# Altium project MCU036A_MSP-EXP430FR2355.PrjPcb (part 2 of 3)
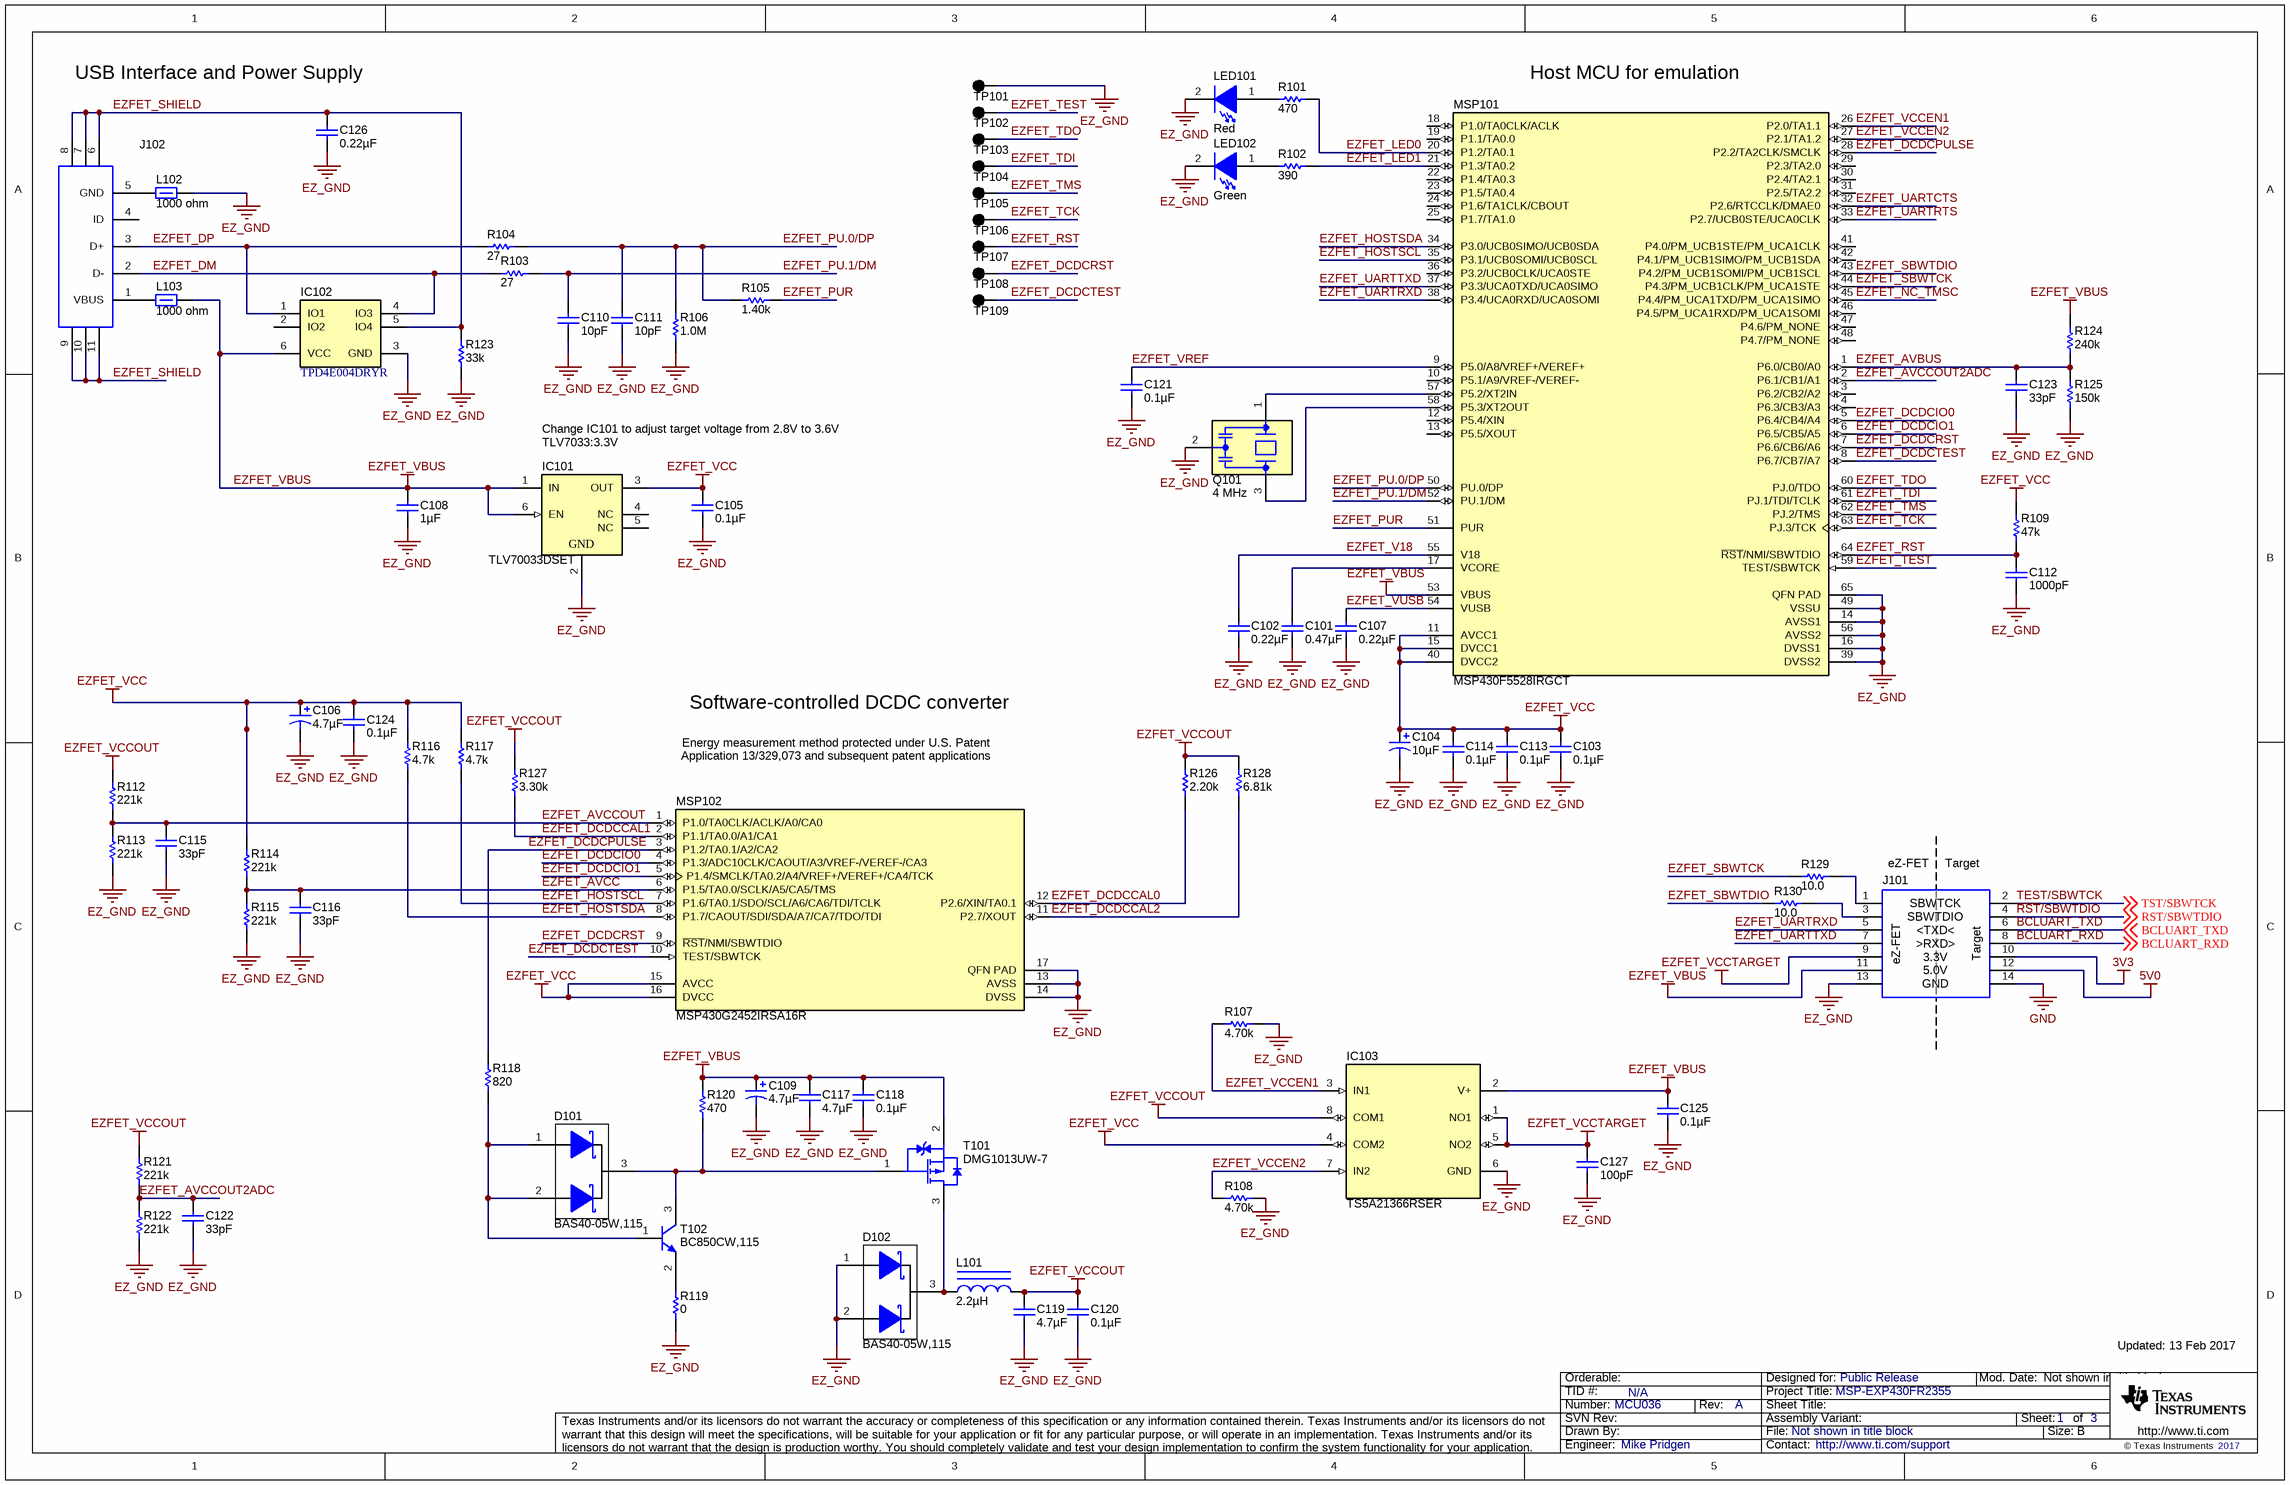
[diagram p3: MCU036A_eZFET_1.4.SchDoc]

## Sheet MCU036A_eZFET_1.4.SchDoc (continued)

### Library data of the parts
C101 = GRM155R61C474KE01: CAP, CERM, 0.47 µF, 16 V, +/- 10%, X5R, 0402; Manufacturer: MuRata; Polarized: N; CompType: Capacitor; Value: 0.47uF; U/M: EA; Cap_F: 0.00000047; Tolerance_%: 10; Value1: Unknown; VDC_V: 16; Value2: 16V; TaMin_C: -55; TaMax_C: 85; SizeArea_mm2: 0.5; SizeAreaWB_mm2: 3; SizeX_mm: 1; SizeZ_mm: 0.6; AEC Category: Q200; SymbolVersion: 2008-07-09; PartNumber: GRM155R61C474KE01; PackageReference: 0402; RoHS: Y; MountType: SMT; Technology: Ceramic; TempCo: X5R; Cap_Case: 0402; SizeY_mm: 0.5; Published: 2008-06-19; Publisher: Texas Instruments; LatestRevisionDate: 2017-01-09; ComponentLink1Description: Datasheet link; ComponentLink1URL: http://psearch.murata.com/capacitor/product/GRM155R61C474KE01%23.pdf; AEC Qualified: ?
C102 C107 = GRM188R61C224KA88D: CAP, CERM, 0.22 µF, 16 V, +/- 10%, X5R, 0603; Manufacturer: MuRata; Polarized: N; CompType: Capacitor; Value: 0.22uF; U/M: EA; Cap_F: 0.00000022; Tolerance_%: 10; Value1: Unknown; VDC_V: 16; Value2: 16V; TaMin_C: -55; TaMax_C: 85; SizeArea_mm2: 1.28; SizeAreaWB_mm2: 4.68; SizeX_mm: 1.6; SizeY_mm: 0.8; SizeZ_mm: 1; AEC Category: Q200; SymbolVersion: 2008-07-09; PartNumber: GRM188R61C224KA88D; PackageReference: 0603; RoHS: Y; MountType: SMT; Technology: Ceramic; TempCo: X5R; Cap_Case: 0603; Published: 2008-06-19; Publisher: Texas Instruments; LatestRevisionDate: 2017-01-09; ComponentLink1Description: Datasheet link; ComponentLink1URL: http://search.murata.co.jp/Ceramy/PnsearchViewAction.do?HnOFG=ON&HnNFG=ON&SEL_CNT=50&sLang=en&sKey=GRM188R61C224KA88D&x=9&y=9&search=startwith; Supplier 1: Digi-Key; Supplier Part Number 1: GRM188R61C224KA88D-ND; Supplier 2: Mouser; Supplier Part Number 2: 81-GRM188R61C224KA8D; AEC Qualified: ?
C103 C105 C113 C114 C118 C120 C121 C124 C125 = GRM155R61A104KA01D: CAP, CERM, 0.1 µF, 10 V, +/- 10%, X5R, 0402; Manufacturer: MuRata; Polarized: N; CompType: Capacitor; Value: 0.1uF; U/M: EA; Cap_F: 0.0000001; Tolerance_%: 10; Value1: Unknown; Value2: 10V; TaMin_C: -55; TaMax_C: 85; SizeArea_mm2: 0.5; SizeAreaWB_mm2: 3; SizeX_mm: 1; SizeZ_mm: 0.6; AEC Category: Q200; SymbolVersion: 2008-07-09; PartNumber: GRM155R61A104KA01D; PackageReference: 0402; RoHS: Y; VDC_V: 10; MountType: SMT; Technology: Ceramic; TempCo: X5R; Cap_Case: 0402; SizeY_mm: 0.5; Published: 2008-06-19; Publisher: Texas Instruments; LatestRevisionDate: 2017-01-09; ComponentLink1Description: Datasheet link; ComponentLink1URL: http://search.murata.co.jp/Ceramy/PnsearchViewAction.do?HnOFG=ON&HnNFG=ON&SEL_CNT=50&sLang=en&sKey=GRM155R61A104KA01D&x=9&y=9&search=startwith; Supplier 1: Digi-Key; Supplier Part Number 1: 490-1318-1-ND; Supplier 2: Mouser; Supplier Part Number 2: 81-GRM155R61A104KA01; Supplier 3: Farnell; Supplier Part Number 3: 1828862; AEC Qualified: ?
C104 = 293D106X0010A2TE3: CAP, TA, 10 µF, 10 V, +/- 20%, 3.4 ohm, SMD; Manufacturer: Vishay-Sprague; Polarized: Y; CompType: Capacitor; Value: 10uF; U/M: EA; Cap_F: 0.00001; Tolerance_%: 20; Value1: 3.4 ohm; VDC_V: 10; Value2: 10V; ESR_ohm: 3.4; IRMS_A: 0.15; TaMin_C: -55; TaMax_C: 125; Cap_Case: A; SizeAreaWB_mm2: 10.92; SizeArea_mm2: 5.12; SizeX_mm: 3.2; SizeY_mm: 1.6; SizeZ_mm: 1.8; AEC Category: Q200; SymbolVersion: 2008-07-09; PartNumber: 293D106X0010A2TE3; PackageReference: 3216-18; RoHS: Y; MountType: SMT; Technology: TA; Series: 293D; Publisher: Texas Instruments; LatestRevisionDate: 2016-12-27; LatestRevisionNote: Updated supplier links; ComponentLink1Description: Datasheet link; ComponentLink1URL: http://www.vishay.com/docs/40002/293d.pdf; Supplier 1: Digi-Key; Supplier Part Number 1: 718-1118-1-ND; Supplier 2: Mouser; Supplier Part Number 2: 74-293D106X0010A2TE3; Supplier 3: Farnell; Supplier Part Number 3: 1432565; AEC Qualified: ?
C106 C109 = 293D475X9010A2TE3: CAP, TA, 4.7 µF, 10 V, +/- 10%, 5 ohm, SMD; Manufacturer: Vishay-Sprague; Polarized: Y; CompType: Capacitor; Value: 4.7uF; U/M: EA; Cap_F: 0.0000047; Tolerance_%: 10; Value1: 5 ohm; Value2: 10V; ESR_ohm: 5; IRMS_A: 0.12; TaMin_C: -55; TaMax_C: 125; Cap_Case: A; SizeAreaWB_mm2: 10.92; SizeArea_mm2: 5.12; SizeX_mm: 3.2; SizeY_mm: 1.6; SizeZ_mm: 1.8; AEC Category: Q200; SymbolVersion: 2008-07-09; PartNumber: 293D475X9010A2TE3; PackageReference: 3216-18; RoHS: Y; VDC_V: 10; MountType: SMT; Technology: TA; Series: 293D; Publisher: Texas Instruments; LatestRevisionDate: 2016-12-27; LatestRevisionNote: Updated supplier links; ComponentLink1Description: Datasheet link; ComponentLink1URL: http://www.vishay.com/docs/40002/293d.pdf; Supplier 1: Digi-Key; Supplier Part Number 1: 718-1146-1-ND; Supplier 2: Mouser; Supplier Part Number 2: 74-293D475X9010A2TE3; Supplier 3: Farnell; Supplier Part Number 3: 197397; AEC Qualified: ?
C108 = GRM185R61A105KE36D: CAP, CERM, 1 µF, 10 V, +/- 10%, X5R, 0603; Manufacturer: MuRata; Polarized: N; CompType: Capacitor; Value: 1uF; U/M: EA; Cap_F: 0.000001; Tolerance_%: 10; Value1: Unknown; Value2: 10V; TaMin_C: -55; TaMax_C: 85; SizeArea_mm2: 1.28; SizeAreaWB_mm2: 4.68; SizeX_mm: 1.6; SizeY_mm: 0.8; SizeZ_mm: 1; AEC Category: Q200; SymbolVersion: 2008-07-09; PartNumber: GRM185R61A105KE36D; PackageReference: 0603; RoHS: Y; VDC_V: 10; MountType: SMT; Technology: Ceramic; TempCo: X5R; Cap_Case: 0603; Published: 2008-06-19; Publisher: Texas Instruments; LatestRevisionDate: 2017-01-25; ComponentLink1Description: Datasheet link; ComponentLink1URL: http://search.murata.co.jp/Ceramy/PnsearchViewAction.do?HnOFG=ON&HnNFG=ON&SEL_CNT=50&sLang=en&sKey=GRM185R61A105KE36D&x=9&y=9&search=startwith; Supplier 1: Digi-Key; Supplier Part Number 1: 490-3893-1-ND; Supplier 2: Mouser; Supplier Part Number 2: 81-GRM185R61A105KE36; AEC Qualified: ?
C110 C111 = GRM1555C1H100JA01D: CAP, CERM, 10 pF, 50 V, +/- 5%, C0G/NP0, 0402; Manufacturer: MuRata; Polarized: N; CompType: Capacitor; Value: 10pF; U/M: EA; Cap_F: 0.00000000001; Tolerance_%: 5; Value1: Unknown; VDC_V: 50; Value2: 50V; TaMin_C: -55; TaMax_C: 125; SizeArea_mm2: 0.5; SizeAreaWB_mm2: 3; SizeX_mm: 1; SizeZ_mm: 0.6; AEC Category: Q200; SymbolVersion: 2008-07-09; PartNumber: GRM1555C1H100JA01D; PackageReference: 0402; RoHS: Y; MountType: SMT; Technology: Ceramic; TempCo: C0G/NP0; Cap_Case: 0402; SizeY_mm: 0.5; Published: 2008-06-19; Publisher: Texas Instruments; LatestRevisionDate: 2017-01-09; ComponentLink1Description: Datasheet link; ComponentLink1URL: http://search.murata.co.jp/Ceramy/PnsearchViewAction.do?HnOFG=ON&HnNFG=ON&SEL_CNT=50&sLang=en&sKey=GRM1555C1H100JA01D&x=9&y=9&search=startwith; Supplier 1: Mouser; Supplier Part Number 1: 81-GRM1555C1H100JA1D; AEC Qualified: ?
C112 = GRM155R71H102KA01D: CAP, CERM, 1000 pF, 50 V, +/- 10%, X7R, 0402; Manufacturer: MuRata; Polarized: N; CompType: Capacitor; Value: 1000pF; U/M: EA; Cap_F: 0.000000001; Tolerance_%: 10; Value1: Unknown; VDC_V: 50; Value2: 50V; TaMin_C: -55; TaMax_C: 125; SizeArea_mm2: 0.5; SizeAreaWB_mm2: 3; SizeX_mm: 1; SizeZ_mm: 0.6; AEC Category: Q200; SymbolVersion: 2008-07-09; PartNumber: GRM155R71H102KA01D; PackageReference: 0402; RoHS: Y; MountType: SMT; Technology: Ceramic; TempCo: X7R; Cap_Case: 0402; SizeY_mm: 0.5; Published: 2008-06-19; Publisher: Texas Instruments; LatestRevisionDate: 2017-01-09; ComponentLink1Description: Datasheet link; ComponentLink1URL: http://search.murata.co.jp/Ceramy/PnsearchViewAction.do?HnOFG=ON&HnNFG=ON&SEL_CNT=50&sLang=en&sKey=GRM155R71H102KA01D&x=9&y=9&search=startwith; Supplier 1: Digi-Key; Supplier Part Number 1: 490-1303-1-ND; Supplier 2: Mouser; Supplier Part Number 2: 81-GRM36X102K50; Supplier 3: Farnell; Supplier Part Number 3: 1828882; AEC Qualified: ?
C115 C116 C122 C123 = GRM1555C1H330JA01D: CAP, CERM, 33 pF, 50 V, +/- 5%, C0G/NP0, 0402; Manufacturer: MuRata; Polarized: N; CompType: Capacitor; Value: 33pF; U/M: EA; Cap_F: 0.000000000033; Tolerance_%: 5; Value1: Unknown; VDC_V: 50; Value2: 50V; TaMin_C: -55; TaMax_C: 125; SizeArea_mm2: 0.5; SizeAreaWB_mm2: 3; SizeX_mm: 1; SizeZ_mm: 0.6; AEC Category: Q200; SymbolVersion: 2008-07-09; PartNumber: GRM1555C1H330JA01D; PackageReference: 0402; RoHS: Y; MountType: SMT; Technology: Ceramic; TempCo: C0G/NP0; Cap_Case: 0402; SizeY_mm: 0.5; Published: 2008-06-19; Publisher: Texas Instruments; LatestRevisionDate: 2017-01-09; ComponentLink1Description: Datasheet link; ComponentLink1URL: http://search.murata.co.jp/Ceramy/PnsearchViewAction.do?HnOFG=ON&HnNFG=ON&SEL_CNT=50&sLang=en&sKey=GRM1555C1H330JA01D&x=9&y=9&search=startwith; Supplier 1: Mouser; Supplier Part Number 1: 81-GRM1555C1H330JA1D; AEC Qualified: ?
C117 C119 = GRM188R61C475KAAJ: CAP, CERM, 4.7 µF, 16 V, +/- 10%, X5R, 0603; Manufacturer: MuRata; Polarized: N; CompType: Capacitor; Value: 4.7uF; U/M: EA; Cap_F: 0.0000047; Tolerance_%: 10; Value1: Unknown; VDC_V: 16; Value2: 16V; TaMin_C: -55; TaMax_C: 85; SizeArea_mm2: 1.28; SizeAreaWB_mm2: 4.68; SizeX_mm: 1.6; SizeY_mm: 0.8; SizeZ_mm: 1; AEC Category: Q200; SymbolVersion: 2008-07-09; PartNumber: GRM188R61C475KAAJ; PackageReference: 0603; RoHS: Y; MountType: SMT; Technology: Ceramic; TempCo: X5R; Cap_Case: 0603; Published: 2008-06-19; Publisher: Texas Instruments; LatestRevisionDate: 2017-01-09; ComponentLink1Description: Datasheet link; ComponentLink1URL: http://psearch.murata.com/capacitor/product/GRM188R61C475KAAJ%23.pdf; Supplier 1: Digi-Key; Supplier Part Number 1: 490-10481-1-ND; Supplier 2: Mouser; Supplier Part Number 2: 81-GRM188R61C475KAJD; AEC Qualified: N; AEC Grade: N/A
C126 = GRM155R61A224KE19D: CAP, CERM, 0.22 µF, 10 V, +/- 10%, X5R, 0402; Manufacturer: MuRata; Polarized: N; CompType: Capacitor; Value: 0.22uF; U/M: EA; Cap_F: 0.00000022; Tolerance_%: 10; Value1: Unknown; Value2: 10V; TaMin_C: -55; TaMax_C: 85; SizeArea_mm2: 0.5; SizeAreaWB_mm2: 3; SizeX_mm: 1; SizeZ_mm: 0.6; AEC Category: Q200; SymbolVersion: 2008-07-09; PartNumber: GRM155R61A224KE19D; PackageReference: 0402; RoHS: Y; VDC_V: 10; MountType: SMT; Technology: Ceramic; TempCo: X5R; Cap_Case: 0402; SizeY_mm: 0.5; Published: 2008-06-19; Publisher: Texas Instruments; LatestRevisionDate: 2017-01-25; ComponentLink1Description: Datasheet link; ComponentLink1URL: http://search.murata.co.jp/Ceramy/PnsearchViewAction.do?HnOFG=ON&HnNFG=ON&SEL_CNT=50&sLang=en&sKey=GRM155R61A224KE19D&x=9&y=9&search=startwith; Supplier 1: Digi-Key; Supplier Part Number 1: 490-3910-1-ND; Supplier 2: Mouser; Supplier Part Number 2: 81-GRM155R61A224KE19; Supplier 3: Farnell; Supplier Part Number 3: 8819718; AEC Qualified: ?
C127 = GRM1555C1H101JA01D: CAP, CERM, 100 pF, 50 V, +/- 5%, C0G/NP0, 0402; Manufacturer: MuRata; Polarized: N; CompType: Capacitor; Value: 100pF; U/M: EA; Cap_F: 0.0000000001; Tolerance_%: 5; Value1: Unknown; VDC_V: 50; Value2: 50V; TaMin_C: -55; TaMax_C: 125; SizeArea_mm2: 0.5; SizeAreaWB_mm2: 3; SizeX_mm: 1; SizeZ_mm: 0.6; AEC Category: Q200; SymbolVersion: 2008-07-09; PartNumber: GRM1555C1H101JA01D; PackageReference: 0402; RoHS: Y; MountType: SMT; Technology: Ceramic; TempCo: C0G/NP0; Cap_Case: 0402; SizeY_mm: 0.5; Published: 2008-06-19; Publisher: Texas Instruments; LatestRevisionDate: 2017-01-30; ComponentLink1Description: Datasheet link; ComponentLink1URL: http://search.murata.co.jp/Ceramy/PnsearchViewAction.do?HnOFG=ON&HnNFG=ON&SEL_CNT=50&sLang=en&sKey=GRM1555C1H101JA01D&x=9&y=9&search=startwith; Supplier 1: Mouser; Supplier Part Number 1: 81-GRM1555C1H101JA1D; AEC Qualified: ?
D101 D102 = BAS40-05W,115: Diode, Schottky, 40 V, 0.12 A, AEC-Q101, SOT-323; Manufacturer: NXP Semiconductor; SymbolCreator: a0412235; U/M: EA; Vf_V: 1; Value: 40V; Value1: 0.12A; Value2: 1V; Io_A: 0.12; Vr_V: 40; TJmax_C: 150; SizeAreaWB_mm2: 10.24; SizeArea_mm2: 4.84; SizeX_mm: 2.2; SizeZ_mm: 1.1; AEC Category: Q101; AEC Qualified: Y; SymbolVersion: 2013-03-27; PartNumber: BAS40-05W,115; PackageReference: SOT-323; CompType: Diode; MountType: SMT; Type: Schottky; RoHS: Y; SizeY_mm: 2.2; Published: 2008-06-26; Publisher: Texas Instruments; LatestRevisionDate: 2017-01-04; ComponentLink1Description: Datasheet link; ComponentLink1URL: http://www.nxp.com/documents/data_sheet/BAS40_1PSXXSB4X_SER.pdf; Supplier 1: Digi-Key; Supplier Part Number 1: 568-7982-1-ND; Supplier 2: Mouser; Supplier Part Number 2: 771-BAS40-05W115; Supplier 3: Farnell; Supplier Part Number 3: 2438945
IC101 = TLV70033DSET: Single Output LDO, 200 mA, Fixed 3.3 V Output, 2 to 5.5 V Input, with Low IQ, 6-pin WSON (DSE), -40 to 125 degC, Green (RoHS & no Sb/Br); Manufacturer: Texas Instruments; Alternate PartNumber: Equivalent; Accuracy(%): 2; Fixed Output Options(V): 3.3; Iout(Max)(A): 0.2; Iq(Typ)(mA): 0.03; SubFamily: Single Channel LDO; Vdo(Typ)(mV): 175; Vin(Max)(V): 5.5; DatasheetVersion: SLVSA00D; PackageVersion: 4207810/A; PackageReference: DSE0006A; PackageDescription: 6-Pin Plastic Small Outline, Body 1.5 x 1.5 mm, Pitch 0.5 mm; Supplier 1: Digi-Key; Supplier Part Number 1: 296-25215-2-ND; Supplier 2: Digi-Key; Supplier Part Number 2: 296-25215-1-ND; Supplier 3: Digi-Key; Supplier Part Number 3: 296-25215-6-ND; Supplier 4: Newark; Supplier Part Number 4: 50R8015; Supplier 5: Mouser; Supplier Part Number 5: 595-TLV70033DSET; Eco-Plan: Green (RoHS & no Sb/Br); Vin(Min)(V): 2; Vout Adj(Max)(V): 3.3; Vout Adj(Min)(V): 3.3; MountType: SMT; PartNumber: TLV70033DSET; ComponentLink1Description: Manufacturer URL; ComponentLink1URL: http://www.ti.com/; ComponentLink2Description: Datasheet; ComponentLink2URL: http://www.ti.com/general/docs/lit/getliterature.tsp?genericPartNumber=TLV70033&fileType=pdf; ComponentLink3Description: Package Specification; ComponentLink3URL: http://www.ti.com/litv/pdf/mpds287; Alternate Manufacturer: Texas Instruments
IC102 = TPD4E004DRYR: ESD-Protection Array for High-Speed Data Interfaces, 4 Channels, -40 to +85 degC, 6-pin SON (DRY), Green (RoHS & no Sb/Br); Manufacturer: Texas Instruments; Alternate PartNumber: Equivalent; 1394 / Firewire: TRUE; Breakdown Voltage(Min)(V): 6; IEC 61000-4-2 Air-Gap(+/- kV): 12; IEC 61000-4-2 Contact(+/- kV): 8; IO Capacitance(Typ)(pF): 1.6; IO Leakage Current(nA): 1; SubFamily: ESD Solution; DatasheetVersion: SLVS729A; PackageVersion: revF, Dec-2011; PackageReference: DRY0006A; PackageDescription: 6-Pin Plastic Small Outline No-Lead, 1 x 1.45 x 0.6 mm Body, 0.5 mm Pitch; Supplier 1: Digi-Key; Supplier Part Number 1: 296-23618-2-ND; Supplier 2: Digi-Key; Supplier Part Number 2: 296-23618-1-ND; Supplier 3: Digi-Key; Supplier Part Number 3: 296-23618-6-ND; Supplier 4: Farnell; Supplier Part Number 4: 1755331; Supplier 5: Newark; Supplier Part Number 5: 85M0177; Supplier 6: Mouser; Supplier Part Number 6: 595-TPD4E004DRYR; Eco-Plan: Green (RoHS & no Sb/Br); Serial ATA / eSATA: TRUE; USB High Speed: TRUE; MountType: SMT; PartNumber: TPD4E004DRYR; ComponentLink1Description: Datasheet; ComponentLink1URL: http://www.ti.com/general/docs/lit/getliterature.tsp?genericPartNumber=TPD4E004&fileType=pdf; ComponentLink2Description: URL Link1; ComponentLink2URL: SamplesURL:http://www.ti.com/product/tpd4e004#samples; Alternate Manufacturer: Texas Instruments
IC103 = TS5A21366RSER: 0.75-Ohm DUAL SPST ANALOG SWITCH WITH 1.8-V COMPATIBLE INPUT LOGIC, RSE0008A (UQFN-8); Manufacturer: Texas Instruments; SymbolCreator: a0411947; SizeArea_mm2: 2.25; SizeAreaWB_mm2: 6.25; SizeX_mm: 1.5; SizeZ_mm: 0.6; CompType: IC; U/M: EA; SymbolVersion: 2015-11-10; PartNumber: TS5A21366RSER; PackageReference: RSE0008A; PackageDescription: UQFN-8; MountType: SMT; SizeY_mm: 1.5; ComponentLink1Description: Datasheet Link; ComponentLink1URL: http://www.ti.com/lit/ds/symlink/ts5a21366.pdf; RoHS: Y; Publisher: Texas Instruments; LatestRevisionDate: 2017-01-06; Alternate Manufacturer: Texas Instruments
J101 = PEC07DAAN: Header, 100mil, 7x2, Tin, TH; Manufacturer: Sullins Connector Solutions; SymbolCreator: a0412235; Pitch_mm: 2.54; Gender: Male; Shrouded: N; Row_Count: 2; Current_A: 3; Voltage_V: 1800; Cert_UL: Y; SymbolVersion: 2017-03-02; PartNumber: PEC07DAAN; PackageReference: Header, 7x2, 100mil, Tin; ClassName: Header; CompType: Header; RoHS: Y; MountType: TH; ComponentLink1Description: Datasheet URL; ComponentLink1URL: http://www.sullinscorp.com/catalogs/77_PAGE108-109_.100_MALE_HDR.pdf; Orientation: Vertical; PinCount: 14; RowSpacing_mm: 2.54; ContactFinish: Tin; Color: Black; Publisher: Texas Instruments; LatestRevisionDate: 2017-03-08; Supplier 1: Digi-Key; Supplier Part Number 1: S2012E-07-ND
J102 = 1051640001: Receptacle, USB 2.0, Micro B, 5 Position, R/A, SMT; Manufacturer: Molex; SymbolCreator: a0411947; Pitch_mm: 0.65; Gender: Female; ContactFinish: Gold; Current_A: 1.8; Voltage_V: 30; Cert_UL: Y; SymbolVersion: 2013-12-17; PartNumber: 1051640001; PackageReference: Receptacle, USB 2.0, Micro B, 5 Pos, 0.65mm Pitch, R/A, SMT; CompType: Receptacle; RoHS: Y; MountType: SMT; ComponentLink1Description: Datasheet URL; ComponentLink1URL: http://www.molex.com/pdm_docs/sd/1051640001_sd.pdf; Orientation: R/A; PinCount: 5; Color: Black; Publisher: Texas Instruments; LatestRevisionDate: 2017-02-03; Supplier 1: Digi-Key; Supplier Part Number 1: WM11263CT-ND; Supplier 2: Mouser; Supplier Part Number 2: 538-105164-0001; Supplier 3: Farnell; Supplier Part Number 3: 2612469
L101 = CBC2518T2R2M: Inductor, Wirewound, Ceramic, 2.2 µH, 0.89 A, 0.13 ohm, SMD; Manufacturer: Taiyo Yuden; Value: 2.2uH; Ind_H: 2.2E-6; Imax_A: 0.89; Irms: 1.1A @ 40C rise; Isat: 0.89A @ 30% inductance drop; DCR_ohm: 0.13; Value2: 0.89A; SizeAreaWB_mm2: 9.8; SizeArea_mm2: 4.5; SizeX_mm: 2.5; SizeY_mm: 1.8; AEC Category: Q200; AEC Qualified: N; SymbolVersion: 2008-07-23; CompType: Inductor; PartNumber: CBC2518T2R2M; Value1: 0.13 ohm; Technology: Wirewound; MountType: SMT; Material: Ceramic; PackageReference: 2.5x1.8x1.8mm; Published: 2008-06-26; Publisher: Texas Instruments; LatestRevisionDate: 2017-01-04; ComponentLink1Description: Datasheet link; ComponentLink1URL: http://www.yuden.co.jp/productdata/catalog/en/wound02_e.pdf; RoHS: Y; SizeZ_mm: 1.8; Supplier 1: Digi-Key; Supplier Part Number 1: 587-1618-1-ND; Supplier 2: Mouser; Supplier Part Number 2: 963-CBC2518T2R2M; AEC Grade: N/A
L102 L103 = BLM18HE102SN1D: Ferrite Bead, 1000 ohm @ 100 MHz, 0.6 A, 0603; Manufacturer: MuRata; Imax_A: 0.6; DCR_ohm: 0.35; Value1: 0.35 ohm; Value2: 0.6A; SizeAreaWB_mm2: 4.68; SizeArea_mm2: 1.28; SizeX_mm: 1.6; SizeY_mm: 0.8; SizeZ_mm: 1; ZTyp@100MHz_Ohm: 1000; SymbolVersion: 2017-01-06; PartNumber: BLM18HE102SN1D; CompType: Ferrite Bead; Value: 1000 ohm; MountType: SMT; PackageReference: 0603; Published: 2014-04-30; Publisher: Texas Instruments; LatestRevisionDate: 2017-01-26; ComponentLink1Description: Datasheet link; ComponentLink1URL: http://search.murata.co.jp/Ceramy/image/img/PDF/ENG/L0110S0101BLM18H.pdf; RoHS: Y; Ztyp@1GHz_Ohm: 1000; Supplier 1: Digi-Key; Supplier Part Number 1: 490-5215-1-ND; Supplier 2: Mouser; Supplier Part Number 2: 81-BLM18HE102SN1D; Supplier 3: Farnell; Supplier Part Number 3: 2443236
LED101 = LTST-C190CKT: LED, Red, SMD; Manufacturer: Lite-On; Vf_V: 2; Value2: 2V; Io_A: 0.02; Tjmax_C: 85; Power_TotalModule: 0.0625; Value1: 0.0625W; U/M: EA; CompType: LED; PartNumber: LTST-C190CKT; SymbolVersion: 2008-12-08; MountType: SMT; RoHS: Y; PackageReference: Red LED, 1.6x0.8x0.8mm; Type: ?; Color: red; Published: 2008-07-11; Publisher: Texas Instruments; ComponentLink1URL: http://optoelectronics.liteon.com/en-us/api/DwonloadFileHandler.ashx?txtSpecNo=DS-22-98-0009&txtPartNo=LTST-C190CKT; ComponentLink1Description: Datasheet link; LatestRevisionDate: 2016-12-22; Supplier 1: Digi-Key; Supplier Part Number 1: 160-1181-1-ND; Supplier 2: Mouser; Supplier Part Number 2: 859-LTST-C190CKT
LED102 = LTST-C190GKT: LED, Green, SMD; Manufacturer: Lite-On; Vf_V: 2.1; Value2: 2.1V; Io_A: 0.02; Power_TotalModule: 0.1; Value1: 0.1W; U/M: EA; CompType: LED; PartNumber: LTST-C190GKT; SymbolVersion: 2008-12-08; MountType: SMT; RoHS: Y; PackageReference: 1.6x0.8x0.8mm; Type: ?; Color: green; Published: 2008-07-11; Publisher: Texas Instruments; ComponentLink1URL: https://sps06.itg.ti.com/sites/KMS/crossdivteams/altium/docs/ComponentDatasheets/LTST-C190GKT.pdf; ComponentLink1Description: Datasheet link; LatestRevisionDate: 2016-12-22; Supplier 1: Digi-Key; Supplier Part Number 1: 160-1183-1-ND; Supplier 2: Mouser; Supplier Part Number 2: 859-LTST-C190GKT
MSP101 = MSP430F5528IRGCT: 25 MHz Mixed Signal Microcontroller with 128 KB Flash, 8192 B SRAM and 47 GPIOs, -40 to 85 degC, 64-pin QFN (RGC), Green (RoHS & no Sb/Br); Alternate Manufacturer: Texas Instruments; Alternate PartNumber: Equivalent; ADC: 12-bit SAR; ADC Channels: 16; Brown Out Reset: Yes; DMA: 3; Flash(KB): 128; Frequency(MHz): 25; GPIO: 47; Multiplier: 32x32; Pin/Package: 64DSBGA, 64VQFN, 80BGA MICROSTAR JUNIOR; SRAM(B): 8192; SubFamily: 5 Series; Timers - 16-bit: 4; USB: 1; USCI_A (UART/LIN/IrDA/SPI): 2; DatasheetVersion: SLAS590I; PackageVersion: 4204106/F, 11/2011; PackageReference: RGC0064B; PackageDescription: 64-Pin Plastic Flat Pack, Body 9 x 9 mm, Pitch 0.5 mm; Comparators: Yes; Eco-Plan: Green (RoHS & no Sb/Br); Real-Time Clock: Yes; SVS: Yes; Temp Sensor: Yes; USCI_B (I2C & SPI): 2; Watchdog: Yes; MountType: SMT; ComponentLink1Description: Manufacturer URL; ComponentLink1URL: http://www.ti.com/; ComponentLink2Description: Datasheet; ComponentLink2URL: http://www.ti.com/general/docs/lit/getliterature.tsp?genericPartNumber=MSP430F5528&fileType=pdf; PartNumber: MSP430F5528IRGCT; Manufacturer: Texas Instruments
MSP102 = MSP430G2452IRSA16R: 16 MHz Mixed Signal Microcontroller with 8 KB Flash, 256 B SRAM and 16 GPIOs, 16-pin QFN (RSA), Green (RoHS & no Sb/Br); Alternate Manufacturer: Texas Instruments; Alternate PartNumber: Equivalent; ADC: 10-bit SAR; ADC Channels: 8; Brown Out Reset: Yes; Frequency(MHz): 16; Pin/Package: 14TSSOP, 16QFN, 20PDIP, 20TSSOP; SRAM(B): 256; SubFamily: Value Line; Timers - 16-bit: 1; USI: (I2C/SPI); DatasheetVersion: SLAS722E; PackageVersion: 4205141/D, 06/2011; PackageReference: RSA0016B; PackageDescription: 16-Pin Plastic Flat Pack, Body 4.00 x 4.00 mm, Pitch 0.65 mm; Cap touch I/O: Yes; Comparators: Yes; Eco-Plan: Green (RoHS & no Sb/Br); Flash(KB): 8; GPIO: 16; Temp Sensor: Yes; Watchdog: Yes; MountType: SMT; Code_JEDEC: MO-220; ComponentLink1Description: Manufacturer URL; ComponentLink1URL: http://www.ti.com/; ComponentLink2Description: Datasheet; ComponentLink2URL: http://www.ti.com/general/docs/lit/getliterature.tsp?genericPartNumber=MSP430G2452&fileType=pdf; PartNumber: MSP430G2452IRSA16R; Manufacturer: Texas Instruments
Q101 = CSTCR4M00G15L99-R0: Resonator, 4MHz, 39pF SMD; Manufacturer: MuRata; SymbolCreator: a0799721; U/M: EA; TaMin_C: 0; TaMax_C: 70; Frequency Stability: ±0.08 %; SymbolVersion: 2016-2-15; PartNumber: CSTCR4M00G15L99-R0; CompType: Resonator; PackageReference: 4.5x1.2x2 mm; MountType: SMT; RoHS: Y; ComponentLink1Description: Datasheet Link; ComponentLink1URL: http://www.murata.com/products/catalog/pdf/p16e.pdf; Publisher: Texas Instruments; LatestRevisionDate: 2017-01-09; Supplier 1: Digi-Key; Supplier Part Number 1: 490-7861-1-ND; Supplier 2: Mouser; Supplier Part Number 2: 81-CSTCR4M00G15L99R0; Supplier 3: Newark; Supplier Part Number 3: 45Y4897
R101 R120 = CRCW0402470RJNED: RES, 470, 5%, 0.063 W, 0402; Manufacturer: Vishay-Dale; CompType: Resistor; Value: 470; Value_Code: 470R; Tolerance_%: 5; Power_W: 0.063; Value2: 0.063W; VDC_V: 50; TempCo: 200 ppm/C; SizeArea_mm2: 0.5; SizeX_mm: 1; SizeZ_mm: 0.6; EIA_Code: E24; U/M: EA; AEC Category: Q200; SymbolVersion: 2009-05-29; PartNumber: CRCW0402470RJNED; PackageReference: 0402; RoHS: Y; Res_ohm: 470; Value1: 5%; MountType: SMT; Technology: Thick Film; SizeY_mm: 0.5; Published: 2008-06-26; Publisher: Texas Instruments; LatestRevisionDate: 2016-12-30; ComponentLink1Description: Datasheet link; ComponentLink1URL: http://www.vishay.com/docs/20035/dcrcwe3.pdf; Supplier 1: Digi-Key; Supplier Part Number 1: 541-470JCT-ND; Supplier 2: Mouser; Supplier Part Number 2: 71-CRCW0402J-470-E3; Supplier 3: Farnell; Supplier Part Number 3: 1537425; AEC Qualified: ?
R102 = CRCW0402390RJNED: RES, 390, 5%, 0.063 W, 0402; Manufacturer: Vishay-Dale; CompType: Resistor; Value: 390; Value_Code: 390R; Tolerance_%: 5; Power_W: 0.063; Value2: 0.063W; VDC_V: 50; TempCo: 200 ppm/C; SizeArea_mm2: 0.5; SizeX_mm: 1; SizeZ_mm: 0.6; EIA_Code: E24; U/M: EA; AEC Category: Q200; SymbolVersion: 2009-05-29; PartNumber: CRCW0402390RJNED; PackageReference: 0402; RoHS: Y; Res_ohm: 390; Value1: 5%; MountType: SMT; Technology: Thick Film; SizeY_mm: 0.5; Published: 2008-06-26; Publisher: Texas Instruments; LatestRevisionDate: 2016-12-30; ComponentLink1Description: Datasheet link; ComponentLink1URL: http://www.vishay.com/docs/20035/dcrcwe3.pdf; Supplier 1: Digi-Key; Supplier Part Number 1: 541-390JCT-ND; Supplier 2: Mouser; Supplier Part Number 2: 71-CRCW0402J-390-E3; Supplier 3: Farnell; Supplier Part Number 3: 1514701; AEC Qualified: ?
R103 R104 = CRCW040227R0JNED: RES, 27, 5%, 0.063 W, 0402; Manufacturer: Vishay-Dale; CompType: Resistor; Value: 27; Value_Code: 27R0; Tolerance_%: 5; Power_W: 0.063; Value2: 0.063W; VDC_V: 50; TempCo: 200 ppm/C; SizeArea_mm2: 0.5; SizeX_mm: 1; SizeZ_mm: 0.6; EIA_Code: E24; U/M: EA; AEC Category: Q200; SymbolVersion: 2009-05-29; PartNumber: CRCW040227R0JNED; PackageReference: 0402; RoHS: Y; Res_ohm: 27; Value1: 5%; MountType: SMT; Technology: Thick Film; SizeY_mm: 0.5; Published: 2008-06-26; Publisher: Texas Instruments; LatestRevisionDate: 2016-12-30; ComponentLink1Description: Datasheet link; ComponentLink1URL: http://www.vishay.com/docs/20035/dcrcwe3.pdf; Supplier 1: Digi-Key; Supplier Part Number 1: 541-27JCT-ND; Supplier 2: Mouser; Supplier Part Number 2: 71-CRCW0402J-27-E3; Supplier 3: Farnell; Supplier Part Number 3: 1514690; AEC Qualified: ?
R105 = CRCW04021K40FKED: RES, 1.40 k, 1%, 0.063 W, 0402; Manufacturer: Vishay-Dale; CompType: Resistor; Value: 1.40k; Res_ohm: 1400; Value_Code: 1k40; Tolerance_%: 1; Power_W: 0.063; Value2: 0.063W; VDC_V: 50; TempCo: 100 ppm/C; SizeArea_mm2: 0.5; SizeZ_mm: 0.6; EIA_Code: E96; U/M: EA; AEC Category: Q200; SymbolVersion: 2009-05-29; PartNumber: CRCW04021K40FKED; PackageReference: 0402; RoHS: Y; Value1: 1%; MountType: SMT; Technology: Thick Film; SizeX_mm: 1; SizeY_mm: 0.5; Published: 2008-06-26; Publisher: Texas Instruments; LatestRevisionDate: 2016-12-30; ComponentLink1Description: Datasheet link; ComponentLink1URL: http://www.vishay.com/docs/20035/dcrcwe3.pdf; Supplier 1: Digi-Key; Supplier Part Number 1: 541-1.40KLCT-ND; Supplier 2: Mouser; Supplier Part Number 2: 71-CRCW0402-1.4K-E3; Supplier 3: Farnell; Supplier Part Number 3: 1469664; AEC Qualified: ?
R106 = CRCW04021M00JNED: RES, 1.0 M, 5%, 0.063 W, 0402; Manufacturer: Vishay-Dale; CompType: Resistor; Value: 1.0Meg; Res_ohm: 1000000; Value_Code: 1M00; Tolerance_%: 5; Power_W: 0.063; Value2: 0.063W; VDC_V: 50; TempCo: 200 ppm/C; SizeArea_mm2: 0.5; SizeX_mm: 1; SizeZ_mm: 0.6; EIA_Code: E24; U/M: EA; AEC Category: Q200; SymbolVersion: 2009-05-29; PartNumber: CRCW04021M00JNED; PackageReference: 0402; RoHS: Y; Value1: 5%; MountType: SMT; Technology: Thick Film; SizeY_mm: 0.5; Published: 2008-06-26; Publisher: Texas Instruments; LatestRevisionDate: 2016-12-30; ComponentLink1Description: Datasheet link; ComponentLink1URL: http://www.vishay.com/docs/20035/dcrcwe3.pdf; Supplier 1: Digi-Key; Supplier Part Number 1: 541-1.0MJCT-ND; Supplier 2: Mouser; Supplier Part Number 2: 71-CRCW0402J-1M-E3; Supplier 3: Farnell; Supplier Part Number 3: 1514661; AEC Qualified: ?
R107 R108 = CRG0402F4K7: RES, 4.70 k, 1%, 0.063 W, 0402; Manufacturer: TE Connectivity; CompType: Resistor; Value: 4.70k; Res_ohm: 4700; Value_Code: 4k70; Tolerance_%: 1; Power_W: 0.063; Value2: 0.063W; TempCo: 100 ppm/C; SizeArea_mm2: 0.5; SizeZ_mm: 0.6; U/M: EA; AEC Category: Q200; AEC Qualified: N; SymbolVersion: 2009-05-29; PartNumber: CRG0402F4K7; PackageReference: 0402; RoHS: Y; Value1: 1%; MountType: SMT; Technology: Thick Film; SizeX_mm: 1; SizeY_mm: 0.5; Published: 2008-06-26; Publisher: Texas Instruments; LatestRevisionDate: 2016-12-30; ComponentLink1Description: Datasheet link; ComponentLink1URL: http://www.te.com/commerce/DocumentDelivery/DDEController?Action=srchrtrv&DocNm=1773204&DocType=DS&DocLang=English; Supplier 1: Digi-Key; Supplier Part Number 1: A121542CT-ND; Supplier 2: Mouser; Supplier Part Number 2: 279-CRG0402F4K7; Supplier 3: Farnell; Supplier Part Number 3: 2331538; AEC Grade: N/A
R109 = CRCW040247K0JNED: RES, 47 k, 5%, 0.063 W, 0402; Manufacturer: Vishay-Dale; CompType: Resistor; Value: 47k; Res_ohm: 47000; Value_Code: 47k0; Tolerance_%: 5; Power_W: 0.063; Value2: 0.063W; VDC_V: 50; TempCo: 200 ppm/C; SizeArea_mm2: 0.5; SizeX_mm: 1; SizeZ_mm: 0.6; EIA_Code: E24; U/M: EA; AEC Category: Q200; SymbolVersion: 2009-05-29; PartNumber: CRCW040247K0JNED; PackageReference: 0402; RoHS: Y; Value1: 5%; MountType: SMT; Technology: Thick Film; SizeY_mm: 0.5; Published: 2008-06-26; Publisher: Texas Instruments; LatestRevisionDate: 2016-12-30; ComponentLink1Description: Datasheet link; ComponentLink1URL: http://www.vishay.com/docs/20035/dcrcwe3.pdf; Supplier 1: Digi-Key; Supplier Part Number 1: 541-47KJCT-ND; Supplier 2: Mouser; Supplier Part Number 2: 71-CRCW0402-J-47K-E3; Supplier 3: Farnell; Supplier Part Number 3: 1514553; AEC Qualified: ?
R112-R115 R121 R122 = CRCW0402221KFKED: RES, 221 k, 1%, 0.063 W, 0402; Manufacturer: Vishay-Dale; CompType: Resistor; Value: 221k; Res_ohm: 221000; Tolerance_%: 1; Power_W: 0.063; Value2: 0.063W; VDC_V: 50; TempCo: 100 ppm/C; SizeArea_mm2: 0.5; SizeZ_mm: 0.6; EIA_Code: E96; U/M: EA; AEC Category: Q200; SymbolVersion: 2009-05-29; PartNumber: CRCW0402221KFKED; PackageReference: 0402; RoHS: Y; Value_Code: 221k; Value1: 1%; MountType: SMT; Technology: Thick Film; SizeX_mm: 1; SizeY_mm: 0.5; Published: 2008-06-26; Publisher: Texas Instruments; LatestRevisionDate: 2016-12-30; ComponentLink1Description: Datasheet link; ComponentLink1URL: http://www.vishay.com/docs/20035/dcrcwe3.pdf; Supplier 1: Digi-Key; Supplier Part Number 1: 541-221KLCT-ND; Supplier 2: Mouser; Supplier Part Number 2: 71-CRCW0402-221K-E3; Supplier 3: Farnell; Supplier Part Number 3: 1151036; AEC Qualified: ?
R116 R117 = CRCW04024K70JNED: RES, 4.7 k, 5%, 0.063 W, 0402; Manufacturer: Vishay-Dale; CompType: Resistor; Value: 4.7k; Res_ohm: 4700; Value_Code: 4k70; Tolerance_%: 5; Power_W: 0.063; Value2: 0.063W; VDC_V: 50; TempCo: 200 ppm/C; SizeArea_mm2: 0.5; SizeX_mm: 1; SizeZ_mm: 0.6; EIA_Code: E24; U/M: EA; AEC Category: Q200; SymbolVersion: 2009-05-29; PartNumber: CRCW04024K70JNED; PackageReference: 0402; RoHS: Y; Value1: 5%; MountType: SMT; Technology: Thick Film; SizeY_mm: 0.5; Published: 2008-06-26; Publisher: Texas Instruments; LatestRevisionDate: 2016-12-30; ComponentLink1Description: Datasheet link; ComponentLink1URL: http://www.vishay.com/docs/20035/dcrcwe3.pdf; Supplier 1: Digi-Key; Supplier Part Number 1: 541-4.7KJCT-ND; Supplier 2: Mouser; Supplier Part Number 2: 71-CRCW0402J-4.7K-E3; Supplier 3: Farnell; Supplier Part Number 3: 1514704; AEC Qualified: ?
R118 = RC0402FR-07820RL: RES, 820, 1%, 0.063 W, 0402; Manufacturer: Yageo America; CompType: Resistor; Value: 820; Value_Code: 820R; Tolerance_%: 1; Power_W: 0.063; Value2: 0.063W; VDC_V: 50; TempCo: 100 ppm/C; SizeArea_mm2: 0.5; SizeZ_mm: 0.6; U/M: EA; AEC Category: Q200; AEC Qualified: N; SymbolVersion: 2009-05-29; PartNumber: RC0402FR-07820RL; PackageReference: 0402; RoHS: Y; Res_ohm: 820; Value1: 1%; MountType: SMT; Technology: Thick Film; SizeX_mm: 1; SizeY_mm: 0.5; Published: 2008-06-26; Publisher: Texas Instruments; LatestRevisionDate: 2016-12-30; ComponentLink1Description: Datasheet link; ComponentLink1URL: http://www.yageo.com/documents/recent/PYu-RC_Group_51_RoHS_L_04.pdf; Supplier 1: Digi-Key; Supplier Part Number 1: 311-820LRCT-ND; Supplier 2: Mouser; Supplier Part Number 2: 603-RC0402FR-07820RL; Supplier 3: Farnell; Supplier Part Number 3: 9239227; AEC Grade: N/A
R119 = CRCW04020000Z0ED: RES, 0, 5%, 0.063 W, 0402; Manufacturer: Vishay-Dale; CompType: Resistor; Value: 0; Value_Code: 0000; Tolerance_%: 5; Power_W: 0.063; Value2: 0.063W; VDC_V: 50; TempCo: 200 ppm/C; SizeArea_mm2: 0.5; SizeX_mm: 1; SizeZ_mm: 0.6; EIA_Code: E24; U/M: EA; AEC Category: Q200; SymbolVersion: 2009-05-29; PartNumber: CRCW04020000Z0ED; PackageReference: 0402; RoHS: Y; Res_ohm: 0; Value1: 5%; MountType: SMT; Technology: Thick Film; SizeY_mm: 0.5; Published: 2008-06-26; Publisher: Texas Instruments; LatestRevisionDate: 2016-12-30; ComponentLink1Description: Datasheet link; ComponentLink1URL: http://www.vishay.com/docs/20035/dcrcwe3.pdf; Supplier 1: Digi-Key; Supplier Part Number 1: 541-0.0JCT-ND; Supplier 2: Mouser; Supplier Part Number 2: 71-CRCW0402-0-E3; Supplier 3: Farnell; Supplier Part Number 3: 1469661; AEC Qualified: ?
R123 = CRCW040233K0JNED: RES, 33 k, 5%, 0.063 W, 0402; Manufacturer: Vishay-Dale; CompType: Resistor; Value: 33k; Res_ohm: 33000; Value_Code: 33k0; Tolerance_%: 5; Power_W: 0.063; Value2: 0.063W; VDC_V: 50; TempCo: 200 ppm/C; SizeArea_mm2: 0.5; SizeX_mm: 1; SizeZ_mm: 0.6; EIA_Code: E24; U/M: EA; AEC Category: Q200; SymbolVersion: 2009-05-29; PartNumber: CRCW040233K0JNED; PackageReference: 0402; RoHS: Y; Value1: 5%; MountType: SMT; Technology: Thick Film; SizeY_mm: 0.5; Published: 2008-06-26; Publisher: Texas Instruments; LatestRevisionDate: 2016-12-30; ComponentLink1Description: Datasheet link; ComponentLink1URL: http://www.vishay.com/docs/20035/dcrcwe3.pdf; Supplier 1: Digi-Key; Supplier Part Number 1: 541-33KJCT-ND; Supplier 2: Mouser; Supplier Part Number 2: 71-CRCW0402J-33K-E3; AEC Qualified: ?
R124 = CRCW0402240KFKED: RES, 240 k, 1%, 0.063 W, 0402; Manufacturer: Vishay-Dale; CompType: Resistor; Value: 240k; Res_ohm: 240000; Tolerance_%: 1; Power_W: 0.063; Value2: 0.063W; VDC_V: 50; TempCo: 100 ppm/C; SizeArea_mm2: 0.5; SizeZ_mm: 0.6; U/M: EA; AEC Category: Q200; SymbolVersion: 2009-05-29; PartNumber: CRCW0402240KFKED; PackageReference: 0402; RoHS: Y; Value_Code: 240k; Value1: 1%; MountType: SMT; Technology: Thick Film; SizeX_mm: 1; SizeY_mm: 0.5; Published: 2008-06-26; Publisher: Texas Instruments; LatestRevisionDate: 2016-12-30; ComponentLink1Description: Datasheet link; ComponentLink1URL: http://www.vishay.com/docs/20035/dcrcwe3.pdf; Supplier 1: Digi-Key; Supplier Part Number 1: 541-240KLCT-ND; Supplier 2: Mouser; Supplier Part Number 2: 71-CRCW0402240KFKED; Supplier 3: Farnell; Supplier Part Number 3: 1892080; AEC Qualified: ?
R125 = CRCW0402150KFKED: RES, 150 k, 1%, 0.063 W, 0402; Manufacturer: Vishay-Dale; CompType: Resistor; Value: 150k; Res_ohm: 150000; Tolerance_%: 1; Power_W: 0.063; Value2: 0.063W; VDC_V: 50; TempCo: 100 ppm/C; SizeArea_mm2: 0.5; SizeZ_mm: 0.6; EIA_Code: E96; U/M: EA; AEC Category: Q200; SymbolVersion: 2009-05-29; PartNumber: CRCW0402150KFKED; PackageReference: 0402; RoHS: Y; Value_Code: 150k; Value1: 1%; MountType: SMT; Technology: Thick Film; SizeX_mm: 1; SizeY_mm: 0.5; Published: 2008-06-26; Publisher: Texas Instruments; LatestRevisionDate: 2016-12-30; ComponentLink1Description: Datasheet link; ComponentLink1URL: http://www.vishay.com/docs/20035/dcrcwe3.pdf; Supplier 1: Digi-Key; Supplier Part Number 1: 541-150KLCT-ND; Supplier 2: Mouser; Supplier Part Number 2: 71-CRCW0402-150K-E3; Supplier 3: Farnell; Supplier Part Number 3: 1652753; AEC Qualified: ?
R126 = CRCW04022K20FKED: RES, 2.20 k, 1%, 0.063 W, 0402; Manufacturer: Vishay-Dale; CompType: Resistor; Value: 2.20k; Res_ohm: 2200; Value_Code: 2k20; Tolerance_%: 1; Power_W: 0.063; Value2: 0.063W; TempCo: 100 ppm/C; SizeArea_mm2: 0.5; SizeZ_mm: 0.6; U/M: EA; AEC Category: Q200; SymbolVersion: 2009-05-29; PartNumber: CRCW04022K20FKED; PackageReference: 0402; RoHS: Y; Value1: 1%; MountType: SMT; Technology: Thick Film; SizeX_mm: 1; SizeY_mm: 0.5; Published: 2008-06-26; Publisher: Texas Instruments; LatestRevisionDate: 2016-12-30; ComponentLink1Description: Datasheet link; ComponentLink1URL: http://www.vishay.com/docs/20035/dcrcwe3.pdf; Supplier 1: Digi-Key; Supplier Part Number 1: 541-2.20KLCT-ND; Supplier 2: Mouser; Supplier Part Number 2: 71-CRCW0402-2.2K-E3; Supplier 3: Farnell; Supplier Part Number 3: 2140802RL; AEC Qualified: ?
R127 = ERJ-2RKF3301X: RES, 3.30 k, 1%, 0.1 W, AEC-Q200 Grade 0, 0402; Manufacturer: Panasonic; CompType: Resistor; Value: 3.30k; Res_ohm: 3300; Value_Code: 3k30; Tolerance_%: 1; Power_W: 0.1; Value2: 0.1W; VDC_V: 50; TempCo: 100 ppm/C; SizeArea_mm2: 0.5; SizeZ_mm: 0.6; U/M: EA; AEC Category: Q200; AEC Qualified: Y; AEC Grade: 0; SymbolVersion: 2009-05-29; PartNumber: ERJ-2RKF3301X; PackageReference: 0402; RoHS: Y; Value1: 1%; MountType: SMT; Technology: Thick Film; SizeX_mm: 1; SizeY_mm: 0.5; Published: 2008-06-26; Publisher: Texas Instruments; LatestRevisionDate: 2016-12-30; ComponentLink1Description: Datasheet link; ComponentLink1URL: http://industrial.panasonic.com/cdbs/www-data/pdf/RDA0000/AOA0000C86.pdf; Supplier 1: Digi-Key; Supplier Part Number 1: P3.30KLCT-ND; Supplier 2: Mouser; Supplier Part Number 2: 667-ERJ-2RKF3301X; Supplier 3: Farnell; Supplier Part Number 3: 2302691
R128 = CRCW04026K81FKED: RES, 6.81 k, 1%, 0.063 W, 0402; Manufacturer: Vishay-Dale; CompType: Resistor; Value: 6.81k; Res_ohm: 6810; Value_Code: 6k81; Tolerance_%: 1; Power_W: 0.063; Value2: 0.063W; VDC_V: 50; TempCo: 100 ppm/C; SizeArea_mm2: 0.5; SizeZ_mm: 0.6; EIA_Code: E96; U/M: EA; AEC Category: Q200; SymbolVersion: 2009-05-29; PartNumber: CRCW04026K81FKED; PackageReference: 0402; RoHS: Y; Value1: 1%; MountType: SMT; Technology: Thick Film; SizeX_mm: 1; SizeY_mm: 0.5; Published: 2008-06-26; Publisher: Texas Instruments; LatestRevisionDate: 2016-12-30; ComponentLink1Description: Datasheet link; ComponentLink1URL: http://www.vishay.com/docs/20035/dcrcwe3.pdf; Supplier 1: Digi-Key; Supplier Part Number 1: 541-6.81KLCT-ND; Supplier 2: Mouser; Supplier Part Number 2: 71-CRCW0402-6.81K-E3; Supplier 3: Farnell; Supplier Part Number 3: 1652819; AEC Qualified: ?
R129 R130 = CRCW040210R0FKED: RES, 10.0, 1%, 0.063 W, 0402; Manufacturer: Vishay-Dale; CompType: Resistor; Value: 10.0; Res_ohm: 10; Value_Code: 10R0; Tolerance_%: 1; Power_W: 0.063; Value2: 0.063W; VDC_V: 50; TempCo: 100 ppm/C; SizeArea_mm2: 0.5; SizeZ_mm: 0.6; EIA_Code: E96; U/M: EA; AEC Category: Q200; SymbolVersion: 2009-05-29; PartNumber: CRCW040210R0FKED; PackageReference: 0402; RoHS: Y; Value1: 1%; MountType: SMT; Technology: Thick Film; SizeX_mm: 1; SizeY_mm: 0.5; Published: 2008-06-26; Publisher: Texas Instruments; LatestRevisionDate: 2017-01-10; ComponentLink1Description: Datasheet link; ComponentLink1URL: http://www.vishay.com/docs/20035/dcrcwe3.pdf; Supplier 1: Digi-Key; Supplier Part Number 1: 541-10.0LCT-ND; Supplier 2: Mouser; Supplier Part Number 2: 71-CRCW0402-10-E3; Supplier 3: Farnell; Supplier Part Number 3: 9238999; AEC Qualified: ?
T101 = DMG1013UW-7: MOSFET, P-CH, -20 V, -0.82 A, SOT-323; Manufacturer: Diodes Inc.; Alternate Manufacturer: None; SymbolCreator: a0411947; U/M: EA; ChType: P; Value: -20V; Value1: 0.75 ohm; Rdson45_ohm: 0.75; Value2: 0.622 nC; QgTyp_nC: 0.622; Vgs_V: -6; SizeAreaWB_mm2: 10.24; SizeArea_mm2: 4.84; SizeX_mm: 2.2; SizeZ_mm: 1.1; AEC Category: Q101; SymbolVersion: 2013-05-16; PartNumber: DMG1013UW-7; PackageReference: SOT-323; CompType: MOSFET; VdsMax_V: -20; IdsMax_A: -0.82; SizeY_mm: 2.2; RoHS: Y; MountType: SMT; Published: 2008-06-19; Publisher: Texas Instruments; LatestRevisionDate: 2017-01-06; LatestRevisionNote: Added parts.; ComponentLink1Description: Datasheet link; ComponentLink1URL: http://www.diodes.com/datasheets/ds31861.pdf; Supplier 1: Digi-Key; Supplier Part Number 1: DMG1013UW-7DICT-ND; Supplier 2: Mouser; Supplier Part Number 2: 621-DMG1013UW-7; AEC Qualified: ?
T102 = BC850CW,115, NXP Semiconductor: Transistor, NPN, 45 V, 0.1 A, SOT-323; CompType: BJT; PNP: 0; NPN: 1; Vceo_V: 45; Vcesat1_V: 0.25; Value: 45 V; IcRated_A: 0.1; Value1: 0.1 A; HfeMax: 800; TaMin_C: -65; TaMax_C: 150; SizeAreaWB_mm2: 10.24; SizeArea_mm2: 4.84; SizeX_mm: 2.2; SizeZ_mm: 1.1; U/M: EA; AEC Category: Q101; SymbolVersion: 2008-07-31; PartNumber: BC850CW,115; Manufacturer: NXP Semiconductor; PackageReference: SOT-323; RoHS: Y; Value2: 800; SizeY_mm: 2.2; Published: 2008-07-31; LatestRevisionDate: 2017-01-03; Publisher: Texas Instruments; ComponentLink1Description: Datasheet link; ComponentLink1URL: http://www.nxp.com/documents/data_sheet/BC849W_850W.pdf; Supplier 1: Digi-Key; Supplier Part Number 1: 568-6076-1-ND; Supplier 2: Mouser; Supplier Part Number 2: 771-BC850CW-T/R; Supplier 3: Farnell; Supplier Part Number 3: 1825971; MountType: SMT; AEC Qualified: ?
TP101-TP109 = 5001: Test Point, Miniature, Black, TH; Manufacturer: Keystone; CompType: Test Point Loop; ContactFinish: Silver; SymbolVersion: 2008-04-04; PartNumber: 5001; PackageReference: Black Miniature Testpoint; RoHS: Y; MountType: TH; ComponentLink1Description: Datasheet URL; ComponentLink1URL: http://www.keyelco.com/userAssets/file/M60-2p60.pdf; Color: Black; Publisher: Texas Instruments; LatestRevisionDate: 2016-09-27; Supplier 1: Digi-Key; Supplier Part Number 1: 36-5001-ND; Supplier 2: Mouser; Supplier Part Number 2: 534-5001